# Altium schematic sheet LED_Band.SchDoc
size A
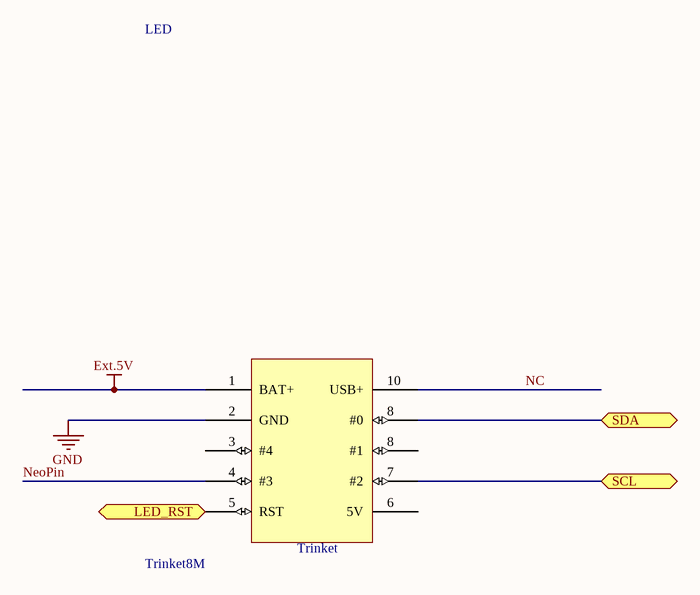
[diagram p0: LED_Band.SchDoc]

## Parts
LED  Trinket8M  [trinket]

## Ports
LED_RST, SCL, SDA

## Nets
Ext.5V: LED.1(BAT+)
GND: LED.2(GND)
LED_RST: LED.5(RST) ; port LED_RST
NC: LED.10(USB+)
NeoPin: LED.4(#3)
SCL: LED.7(#2) ; port SCL
SDA: LED.8(#0) ; port SDA

Not connected (* = marked no-connect by the designer): LED 3(#4) 6(5V)

## Notes on the sheet
- (in symbol Trinket8M) Trinket